# EAGLE schematic Domuino (EAGLE 7.6.0)
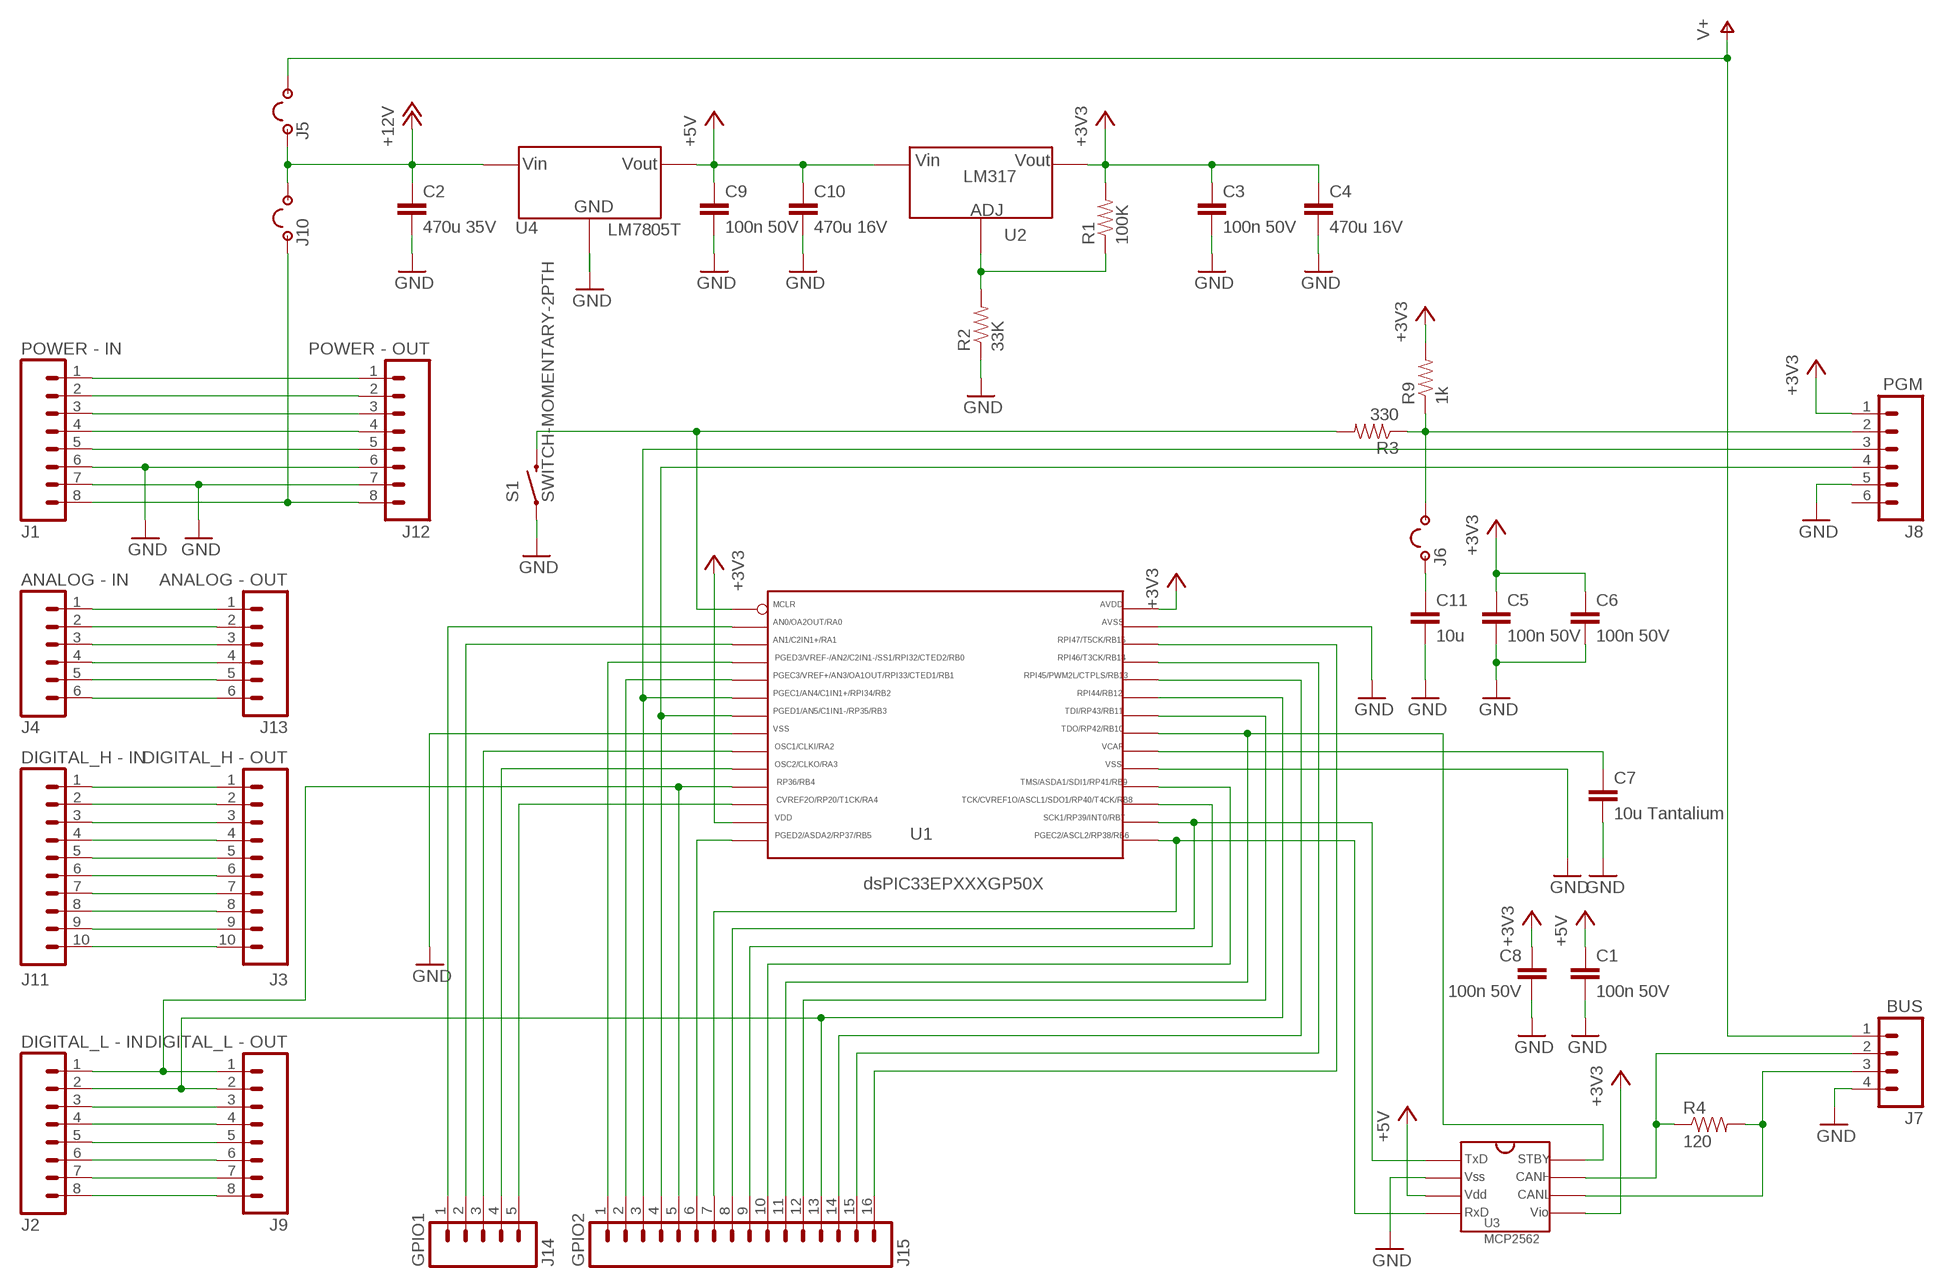
[diagram p0: schematic, sheet 1]

## Parts
C1  100n 50V  0.1UF-50V-20%(PTH)KIT-EZ  [CAP-PTH-SMALL-KIT]
C2  470u 35V  0.1UF-50V-20%(PTH)KIT-EZ  [CAP-PTH-SMALL-KIT]
C3  100n 50V  0.1UF-50V-20%(PTH)KIT-EZ  [CAP-PTH-SMALL-KIT]
C4  470u 16V  0.1UF-50V-20%(PTH)KIT-EZ  [CAP-PTH-SMALL-KIT]
C5  100n 50V  0.1UF-50V-20%(PTH)KIT-EZ  [CAP-PTH-SMALL-KIT]
C6  100n 50V  0.1UF-50V-20%(PTH)KIT-EZ  [CAP-PTH-SMALL-KIT]
C7  10u Tantalium  0.1UF-50V-20%(PTH)KIT-EZ  [CAP-PTH-SMALL-KIT]
C8  100n 50V  0.1UF-50V-20%(PTH)KIT-EZ  [CAP-PTH-SMALL-KIT]
C9  100n 50V  0.1UF-50V-20%(PTH)KIT-EZ  [CAP-PTH-SMALL-KIT]
C10  470u 16V  0.1UF-50V-20%(PTH)KIT-EZ  [CAP-PTH-SMALL-KIT]
C11  10u  0.1UF-50V-20%(PTH)KIT-EZ  [CAP-PTH-SMALL-KIT]
J1  POWER - IN  M08  [1X08_ROUND]
J2  DIGITAL_L - IN  M08  [1X08_ROUND]
J3  DIGITAL_H - OUT  M10SILK_FEMALE_PTH  [1X10]
J4  ANALOG - IN  M06SILK_FEMALE_PTH  [1X06]
J5  JUMPER2  [JUMPER2]
J6  JUMPER2  [JUMPER2]
J7  BUS  M04POLAR  [MOLEX-1X4]
J8  PGM  M06SILK_FEMALE_PTH  [1X06]
J9  DIGITAL_L - OUT  M08  [1X08_ROUND]
J10  JUMPER2  [JUMPER2]
J11  DIGITAL_H - IN  M10SILK_FEMALE_PTH  [1X10]
J12  POWER - OUT  M08  [1X08_ROUND]
J13  ANALOG - OUT  M06SILK_FEMALE_PTH  [1X06]
J14  GPIO1  M05PTH  [1X05]
J15  GPIO2  M16PTH  [1X16]
R1  100K  100KOHM-1/4W-1%(PTH)HORIZ  [AXIAL-0.3]
R2  33K  100KOHM-1/4W-1%(PTH)HORIZ  [AXIAL-0.3]
R3  330  100KOHM-1/4W-1%(PTH)HORIZ  [AXIAL-0.3]
R4  120  100KOHM-1/4W-1%(PTH)HORIZ  [AXIAL-0.3]
R9  1k  100KOHM-1/4W-1%(PTH)HORIZ  [AXIAL-0.3]
S1  SWITCH-MOMENTARY-2PTH  [TACTILE-PTH]
U1  DSPIC33EPXXXGP50X_SPDIP  [SPDIP-28PIN]
U2  LM317_TO220  [TO220]
U3  MCP2562_RDIP-8PIN  [RPDIP-8PIN]
U4  LM7805T_TO220  [TO220]

## Nets
+3V3: C3.1 C4.1 C5.1 C6.1 C8.1 J8.1 R1.P$2 R9.P$2 U1.P$13 U1.P$28 U2.P$2 U3.P$5
+5V: C1.1 C9.1 C10.1 U2.P$3 U3.P$3 U4.P$3
+12V: C2.1 J5.P$1 J10.P$2 U4.P$1
GND: C1.2 C2.2 C3.2 C4.2 C5.2 C6.2 C7.2 C8.2 C9.2 C10.2 C11.2 J1.6 J1.7 J7.4 J8.5 J12.6 J12.7 R2.P$1 S1.1 U1.P$8 U1.P$19 U1.P$27 U3.P$2 U4.P$2
N$1: J1.8 J10.P$1 J12.8
N$2: R1.P$1 R2.P$2 U2.P$1
N$3: J4.4 J13.4
N$4: C11.1 J6.P$1
N$5: J4.5 J13.5
N$6: J4.6 J13.6
N$7: R3.P$2 S1.3 U1.P$1
N$8: J8.3 J15.3 U1.P$6
N$9: J8.4 J15.4 U1.P$7
N$10: J7.2 R4.P$1 U3.P$7
N$11: J7.3 R4.P$2 U3.P$6
N$12: J15.8 U1.P$16 U3.P$1
N$13: J15.7 U1.P$15 U3.P$4
N$14: J3.1 J11.1
N$15: J15.11 U1.P$21 U3.P$8
N$16: J6.P$2 J8.2 R3.P$1 R9.P$1
N$17: J3.2 J11.2
N$18: J3.3 J11.3
N$19: J3.4 J11.4
N$20: J3.5 J11.5
N$21: J3.6 J11.6
N$22: J3.7 J11.7
N$23: J3.8 J11.8
N$24: J3.9 J11.9
N$25: J3.10 J11.10
N$26: J2.1 J9.1 J15.5 U1.P$11
N$27: C7.1 U1.P$20
N$28: J15.14 U1.P$24
N$29: J2.3 J9.3
N$30: J2.4 J9.4
N$31: J2.5 J9.5
N$32: J2.6 J9.6
N$33: J2.7 J9.7
N$34: J2.8 J9.8
N$35: J1.1 J12.1
N$36: J1.2 J12.2
N$37: J1.3 J12.3
N$38: J1.4 J12.4
N$39: J1.5 J12.5
N$40: J4.1 J13.1
N$41: J4.2 J13.2
N$42: J4.3 J13.3
N$43: J14.5 U1.P$12
N$44: J14.4 U1.P$10
N$45: J14.3 U1.P$9
N$46: J14.2 U1.P$3
N$47: J14.1 U1.P$2
N$48: J15.1 U1.P$4
N$49: J15.2 U1.P$5
N$50: J15.6 U1.P$14
N$51: J15.12 U1.P$22
N$52: J15.9 U1.P$17
N$53: J15.10 U1.P$18
N$54: J2.2 J9.2 J15.13 U1.P$23
N$55: J15.15 U1.P$25
N$56: J15.16 U1.P$26
V+: J5.P$2 J7.1
Unconnected: J8.6

## Library data of the parts
C1-C11 = SparkFun-Capacitors:0.1UF-50V-20%(PTH): CAP-08370; PROD_ID: CAP-08370
J1 J12 = SparkFun-Connectors:M08: Header 8 Standard 8-pin 0.1" header. Use with straight break away headers (SKU : PRT-00116), right angle break away headers (PRT-00553), swiss pins (PRT-00743), machine pins (PRT-00117), and female headers (PRT-00115).; PROD_ID: POWER
J2 J9 = SparkFun-Connectors:M08: Header 8 Standard 8-pin 0.1" header. Use with straight break away headers (SKU : PRT-00116), right angle break away headers (PRT-00553), swiss pins (PRT-00743), machine pins (PRT-00117), and female headers (PRT-00115).; PROD_ID: CONN-08437
J3 J11 = SparkFun-Connectors:M10: Header 10 Standard 10-pin 0.1" header. Use with straight break away headers (SKU : PRT-00116), right angle break away headers (PRT-00553), swiss pins (PRT-00743), machine pins (PRT-00117), and female headers (PRT-00115).; PROD_ID: CONN-11563
J4 J8 J13 = SparkFun-Connectors:M06: Header 6 Standard 6-pin 0.1" header. Use with straight break away headers (SKU : PRT-00116), right angle break away headers (PRT-00553), swiss pins (PRT-00743), machine pins (PRT-00117), and female headers (PRT-00115). Molex polarized connector foot print use with SKU : PRT-08094 with associated crimp pins and housings. NOTES ON THE VARIANTS LOCK and LOCK_LONGPADS... This footprint was designed to help hold the alignment of a through-hole component (i.e. 6-pin header) while soldering it into place. You may notice that each hole has been shifted either up or down by 0.005 of an inch from it's more standard position (which is a perfectly straight line). This slight alteration caused the pins (the squares in the middle) to touch the edges of the holes. Because they are alternating, it causes a "brace" to hold the component in place. 0.005 has proven to be the perfect amount of "off-center" position when using our standard breakaway headers. Although looks a little odd when you look at the bare footprint, once you have a header in there, the alteration is very hard to notice. Also,if you push a header all the way into place, it is covered up entirely on the bottom side. This idea of altering the position of holes to aid alignment will be further integrated into the Sparkfun Library for other footprints. It can help hold any component with 3 or more connection pins.; PROD_ID: CONN-08437
J5 J6 J10 = Luca:JUMPER2
J7 = SparkFun-Connectors:M04: Header 4 Standard 4-pin 0.1" header. Use with straight break away headers (SKU : PRT-00116), right angle break away headers (PRT-00553), swiss pins (PRT-00743), machine pins (PRT-00117), and female headers (PRT-00115). Molex polarized connector foot print use with SKU : PRT-08231 with associated crimp pins and housings. 1MM SMD Version SKU: PRT-10208
J14 = SparkFun-Connectors:M05: Header 5 Standard 5-pin 0.1" header. Use with straight break away headers (SKU : PRT-00116), right angle break away headers (PRT-00553), swiss pins (PRT-00743), machine pins (PRT-00117), and female headers (PRT-00115). Molex polarized connector foot print use with SKU : PRT-08230 with associated crimp pins and housings.
J15 = SparkFun-Connectors:M16: 1x16 .1" header
R1 = SparkFun-Resistors:100KOHM-1/4W-1%(PTH): RES-12184; PROD_ID: RES-12184
R2-R4 R9 = SparkFun-Resistors:100KOHM-1/4W-1%(PTH): RES-12184; PROD_ID: RES-12184; VALUE: 100K
S1 = SparkFun-Electromechanical:SWITCH-MOMENTARY-2: Various NO switches- pushbuttons, reed, etc; PROD_ID: SWCH-08441
U1 = Luca:DSPIC33EPXXXGP50X
U2 = Luca:LM317
U3 = Luca:MCP2562
U4 = Luca:LM7805T